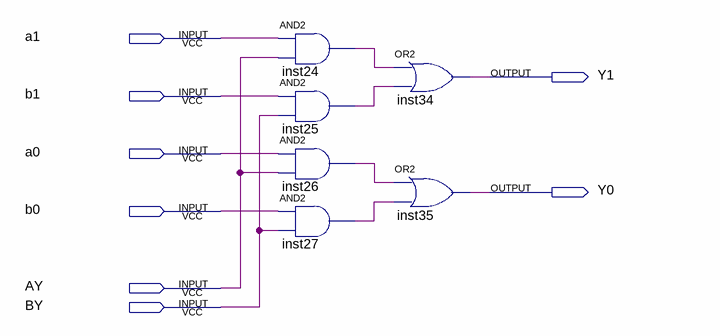
[diagram p0: schematic sheet]
// Quartus schematic Selector2.bdf as structural Verilog: 6 symbols, 8 pins
module Selector2 (
  input  a1,
  input  b1,
  input  a0,
  input  b0,
  input  AY,
  input  BY,
  output Y1,
  output Y0
);

  wire inst24_out, inst25_out, inst26_out, inst27_out;

  and inst24 (inst24_out, a1, AY);
  and inst25 (inst25_out, b1, BY);
  and inst26 (inst26_out, a0, AY);
  and inst27 (inst27_out, b0, BY);
  or inst34 (Y1, inst24_out, inst25_out);
  or inst35 (Y0, inst26_out, inst27_out);
endmodule
